# Altium schematic sheet RAM&GPIO.SchDoc: {Наименование}
size 420 x 297 mm; DocumentNumber: ПЛАС.ХХХХХХ.ХХХ ХХ; SheetNumber: 9; SheetTotal: 11; PageSetup: Record=PageOptions|CenterHorizontal=False|CenterVertical=False|PrintScale=0.95|XCorrection=0.00|YCorrection=0.00|PrintKind=1|BorderSize=5000000|LeftOffset=0|BottomOffset=0|Orientation=1|PaperLength=1000|PaperWidth=1000|Scale=100|PaperSource=15|PrintQuality=600|MediaType=1|DitherType=10|PaperKind=A4|PrintScaleMode=1; Rule: PcbType=ProtelPcb
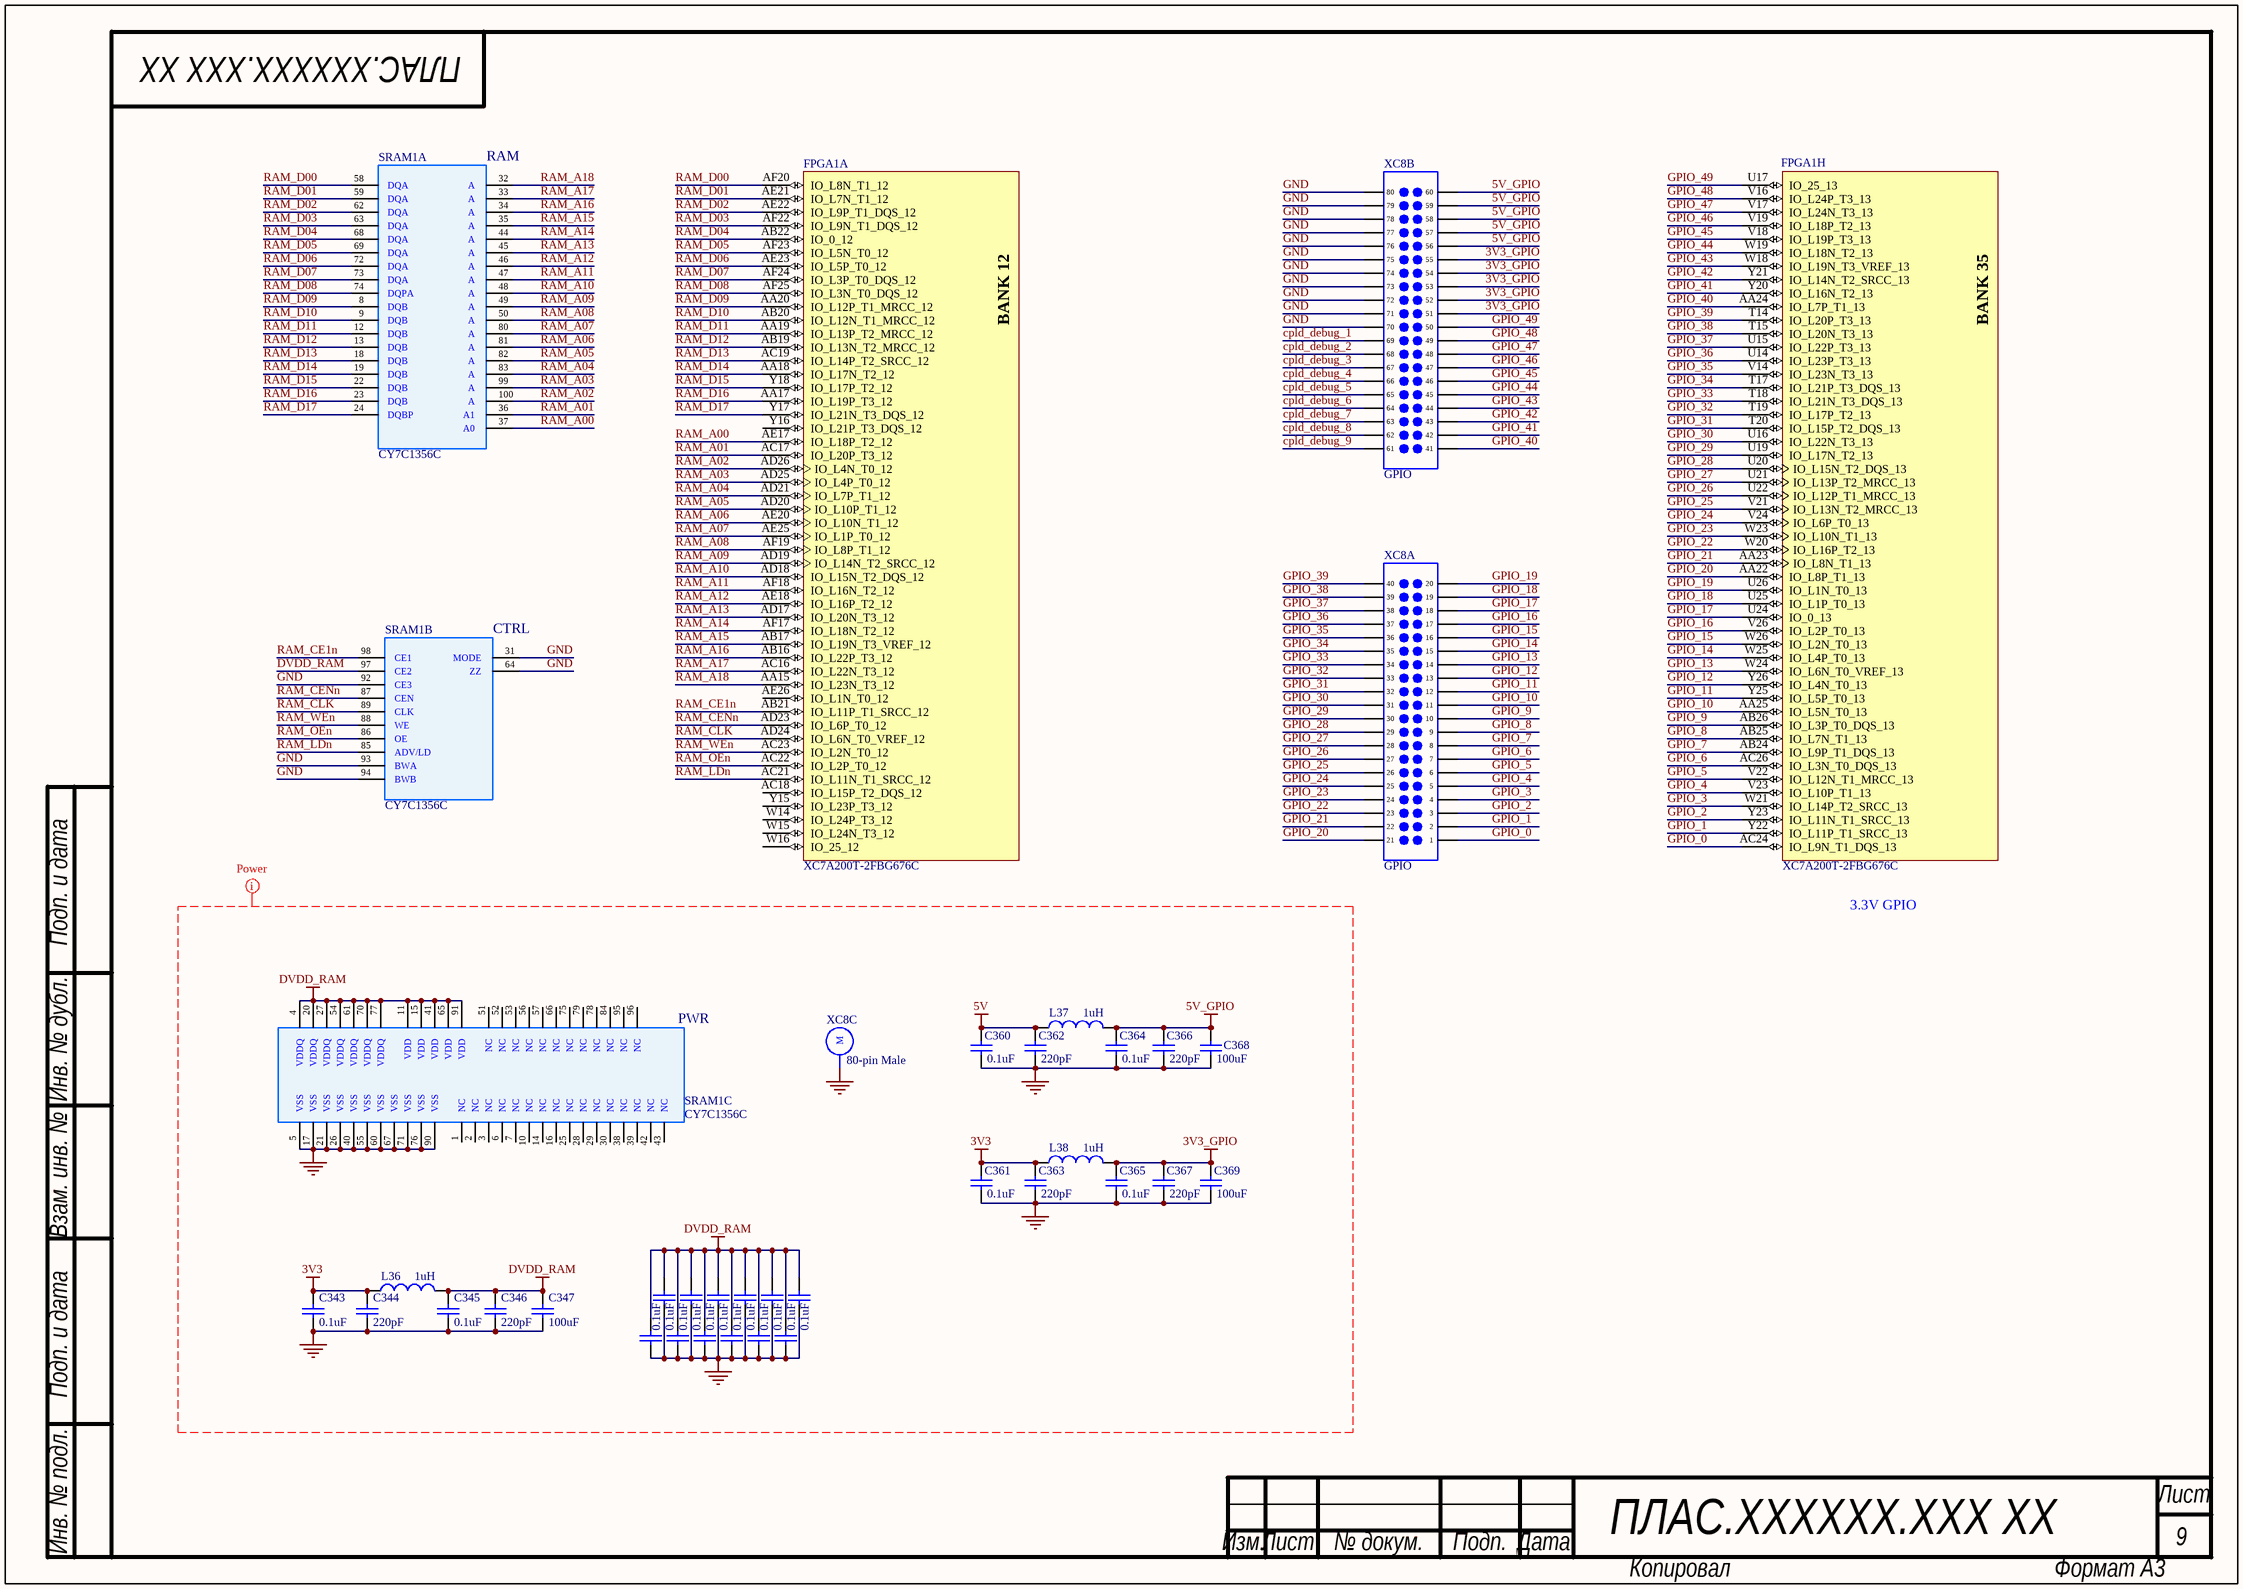
[diagram p0: RAM&GPIO.SchDoc]

## Parts
C343  value 0.1uF  [C0603]  (hidden comment: Cap)
C344  value 220pF  [C0603]  (hidden comment: Cap)
C345  value 0.1uF  [C0603]  (hidden comment: Cap)
C346  value 220pF  [C0603]  (hidden comment: Cap)
C347  value 100uF  [C1210]  (hidden comment: Cap)
C348  value 0.1uF  [С0402]  (hidden comment: Cap)
C349  value 0.1uF  [С0402]  (hidden comment: Cap)
C350  value 0.1uF  [С0402]  (hidden comment: Cap)
C351  value 0.1uF  [С0402]  (hidden comment: Cap)
C352  value 0.1uF  [С0402]  (hidden comment: Cap)
C353  value 0.1uF  [С0402]  (hidden comment: Cap)
C354  value 0.1uF  [С0402]  (hidden comment: Cap)
C355  value 0.1uF  [С0402]  (hidden comment: Cap)
C356  value 0.1uF  [С0402]  (hidden comment: Cap)
C357  value 0.1uF  [С0402]  (hidden comment: Cap)
C358  value 0.1uF  [С0402]  (hidden comment: Cap)
C359  value 0.1uF  [С0402]  (hidden comment: Cap)
C360  value 0.1uF  [C0603]  (hidden comment: Cap)
C361  value 0.1uF  [C0603]  (hidden comment: Cap)
C362  value 220pF  [C0603]  (hidden comment: Cap)
C363  value 220pF  [C0603]  (hidden comment: Cap)
C364  value 0.1uF  [C0603]  (hidden comment: Cap)
C365  value 0.1uF  [C0603]  (hidden comment: Cap)
C366  value 220pF  [C0603]  (hidden comment: Cap)
C367  value 220pF  [C0603]  (hidden comment: Cap)
C368  value 100uF  [C1210]  (hidden comment: Cap)
C369  value 100uF  [C1210]  (hidden comment: Cap)
FPGA1  XC7A200T-2FBG676C  [FGG676]  (parts A,H of 14)
L36  value 1uH  [L1210_Murata]  (hidden comment: Inductor_LF)
L37  value 1uH  [L1210_Murata LQH]  (hidden comment: Inductor_LF)
L38  value 1uH  [L1210_Murata LQH]  (hidden comment: Inductor_LF)
SRAM1  CY7C1356C  [TQFP-100]  (parts A,B,C of 3)
XC8  GPIO  [Molex_465572545]  (parts A,B,C of 3)

## Nets
3V3: C343.1 C344.1 C361.1 C363.1 L36.2 L38.2
3V3_GPIO: C365.1 C367.1 C369.2 L38.1 XC8.51 XC8.52 XC8.53 XC8.54 XC8.55
5V: C360.1 C362.1 L37.2
5V_GPIO: C364.1 C366.1 C368.1 L37.1 XC8.56 XC8.57 XC8.58 XC8.59 XC8.60
DVDD_RAM: C345.1 C346.1 C347.2 C348.2 C349.2 C350.2 C351.2 C352.2 C353.2 C354.2 C355.2 C356.2 C357.2 C358.2 C359.2 L36.1 SRAM1.4(VDDQ) SRAM1.11(VDD) SRAM1.15(VDD) SRAM1.20(VDDQ) SRAM1.27(VDDQ) SRAM1.41(VDD) SRAM1.54(VDDQ) SRAM1.61(VDDQ) SRAM1.65(VDD) SRAM1.70(VDDQ) SRAM1.77(VDDQ) SRAM1.91(VDD) SRAM1.97(CE2)
GND: C343.2 C344.2 C345.2 C346.2 C347.1 C348.1 C349.1 C350.1 C351.1 C352.1 C353.1 C354.1 C355.1 C356.1 C357.1 C358.1 C359.1 C360.2 C361.2 C362.2 C363.2 C364.2 C365.2 C366.2 C367.2 C368.2 C369.1 SRAM1.5(VSS) SRAM1.17(VSS) SRAM1.21(VSS) SRAM1.26(VSS) SRAM1.31(MODE) SRAM1.40(VSS) SRAM1.55(VSS) SRAM1.60(VSS) SRAM1.64(ZZ) SRAM1.67(VSS) SRAM1.71(VSS) SRAM1.76(VSS) SRAM1.90(VSS) SRAM1.92(CE3) SRAM1.93(BWA) SRAM1.94(BWB) XC8.0(M) XC8.70 XC8.71 XC8.72 XC8.73 XC8.74 XC8.75 XC8.76 XC8.77 XC8.78 XC8.79 XC8.80
cpld_debug_1: XC8.69
cpld_debug_2: XC8.68
cpld_debug_3: XC8.67
cpld_debug_4: XC8.66
cpld_debug_5: XC8.65
cpld_debug_6: XC8.64
cpld_debug_7: XC8.63
cpld_debug_8: XC8.62
cpld_debug_9: XC8.61
GPIO_0: FPGA1.AC24(IO_L9N_T1_DQS_13) XC8.1
GPIO_1: FPGA1.Y22(IO_L11P_T1_SRCC_13) XC8.2
GPIO_2: FPGA1.Y23(IO_L11N_T1_SRCC_13) XC8.3
GPIO_3: FPGA1.W21(IO_L14P_T2_SRCC_13) XC8.4
GPIO_4: FPGA1.V23(IO_L10P_T1_13) XC8.5
GPIO_5: FPGA1.V22(IO_L12N_T1_MRCC_13) XC8.6
GPIO_6: FPGA1.AC26(IO_L3N_T0_DQS_13) XC8.7
GPIO_7: FPGA1.AB24(IO_L9P_T1_DQS_13) XC8.8
GPIO_8: FPGA1.AB25(IO_L7N_T1_13) XC8.9
GPIO_9: FPGA1.AB26(IO_L3P_T0_DQS_13) XC8.10
GPIO_10: FPGA1.AA25(IO_L5N_T0_13) XC8.11
GPIO_11: FPGA1.Y25(IO_L5P_T0_13) XC8.12
GPIO_12: FPGA1.Y26(IO_L4N_T0_13) XC8.13
GPIO_13: FPGA1.W24(IO_L6N_T0_VREF_13) XC8.14
GPIO_14: FPGA1.W25(IO_L4P_T0_13) XC8.15
GPIO_15: FPGA1.W26(IO_L2N_T0_13) XC8.16
GPIO_16: FPGA1.V26(IO_L2P_T0_13) XC8.17
GPIO_17: FPGA1.U24(IO_0_13) XC8.18
GPIO_18: FPGA1.U25(IO_L1P_T0_13) XC8.19
GPIO_19: FPGA1.U26(IO_L1N_T0_13) XC8.20
GPIO_20: FPGA1.AA22(IO_L8P_T1_13) XC8.21
GPIO_21: FPGA1.AA23(IO_L8N_T1_13) XC8.22
GPIO_22: FPGA1.W20(IO_L16P_T2_13) XC8.23
GPIO_23: FPGA1.W23(IO_L10N_T1_13) XC8.24
GPIO_24: FPGA1.V24(IO_L6P_T0_13) XC8.25
GPIO_25: FPGA1.V21(IO_L13N_T2_MRCC_13) XC8.26
GPIO_26: FPGA1.U22(IO_L12P_T1_MRCC_13) XC8.27
GPIO_27: FPGA1.U21(IO_L13P_T2_MRCC_13) XC8.28
GPIO_28: FPGA1.U20(IO_L15N_T2_DQS_13) XC8.29
GPIO_29: FPGA1.U19(IO_L17N_T2_13) XC8.30
GPIO_30: FPGA1.U16(IO_L22N_T3_13) XC8.31
GPIO_31: FPGA1.T20(IO_L15P_T2_DQS_13) XC8.32
GPIO_32: FPGA1.T19(IO_L17P_T2_13) XC8.33
GPIO_33: FPGA1.T18(IO_L21N_T3_DQS_13) XC8.34
GPIO_34: FPGA1.T17(IO_L21P_T3_DQS_13) XC8.35
GPIO_35: FPGA1.V14(IO_L23N_T3_13) XC8.36
GPIO_36: FPGA1.U14(IO_L23P_T3_13) XC8.37
GPIO_37: FPGA1.U15(IO_L22P_T3_13) XC8.38
GPIO_38: FPGA1.T15(IO_L20N_T3_13) XC8.39
GPIO_39: FPGA1.T14(IO_L20P_T3_13) XC8.40
GPIO_40: FPGA1.AA24(IO_L7P_T1_13) XC8.41
GPIO_41: FPGA1.Y20(IO_L16N_T2_13) XC8.42
GPIO_42: FPGA1.Y21(IO_L14N_T2_SRCC_13) XC8.43
GPIO_43: FPGA1.W18(IO_L19N_T3_VREF_13) XC8.44
GPIO_44: FPGA1.W19(IO_L18N_T2_13) XC8.45
GPIO_45: FPGA1.V18(IO_L19P_T3_13) XC8.46
GPIO_46: FPGA1.V19(IO_L18P_T2_13) XC8.47
GPIO_47: FPGA1.V17(IO_L24N_T3_13) XC8.48
GPIO_48: FPGA1.V16(IO_L24P_T3_13) XC8.49
GPIO_49: FPGA1.U17(IO_25_13) XC8.50
RAM_A00: FPGA1.AE17(IO_L18P_T2_12) SRAM1.37(A0)
RAM_A01: FPGA1.AC17(IO_L20P_T3_12) SRAM1.36(A1)
RAM_A02: FPGA1.AD26(IO_L4N_T0_12) SRAM1.100(A)
RAM_A03: FPGA1.AD25(IO_L4P_T0_12) SRAM1.99(A)
RAM_A04: FPGA1.AD21(IO_L7P_T1_12) SRAM1.83(A)
RAM_A05: FPGA1.AD20(IO_L10P_T1_12) SRAM1.82(A)
RAM_A06: FPGA1.AE20(IO_L10N_T1_12) SRAM1.81(A)
RAM_A07: FPGA1.AE25(IO_L1P_T0_12) SRAM1.80(A)
RAM_A08: FPGA1.AF19(IO_L8P_T1_12) SRAM1.50(A)
RAM_A09: FPGA1.AD19(IO_L14N_T2_SRCC_12) SRAM1.49(A)
RAM_A10: FPGA1.AD18(IO_L15N_T2_DQS_12) SRAM1.48(A)
RAM_A11: FPGA1.AF18(IO_L16N_T2_12) SRAM1.47(A)
RAM_A12: FPGA1.AE18(IO_L16P_T2_12) SRAM1.46(A)
RAM_A13: FPGA1.AD17(IO_L20N_T3_12) SRAM1.45(A)
RAM_A14: FPGA1.AF17(IO_L18N_T2_12) SRAM1.44(A)
RAM_A15: FPGA1.AB17(IO_L19N_T3_VREF_12) SRAM1.35(A)
RAM_A16: FPGA1.AB16(IO_L22P_T3_12) SRAM1.34(A)
RAM_A17: FPGA1.AC16(IO_L22N_T3_12) SRAM1.33(A)
RAM_A18: FPGA1.AA15(IO_L23N_T3_12) SRAM1.32(A)
RAM_CE1n: FPGA1.AB21(IO_L11P_T1_SRCC_12) SRAM1.98(CE1)
RAM_CENn: FPGA1.AD23(IO_L6P_T0_12) SRAM1.87(CEN)
RAM_CLK: FPGA1.AD24(IO_L6N_T0_VREF_12) SRAM1.89(CLK)
RAM_D00: FPGA1.AF20(IO_L8N_T1_12) SRAM1.58(DQA)
RAM_D01: FPGA1.AE21(IO_L7N_T1_12) SRAM1.59(DQA)
RAM_D02: FPGA1.AE22(IO_L9P_T1_DQS_12) SRAM1.62(DQA)
RAM_D03: FPGA1.AF22(IO_L9N_T1_DQS_12) SRAM1.63(DQA)
RAM_D04: FPGA1.AB22(IO_0_12) SRAM1.68(DQA)
RAM_D05: FPGA1.AF23(IO_L5N_T0_12) SRAM1.69(DQA)
RAM_D06: FPGA1.AE23(IO_L5P_T0_12) SRAM1.72(DQA)
RAM_D07: FPGA1.AF24(IO_L3P_T0_DQS_12) SRAM1.73(DQA)
RAM_D08: FPGA1.AF25(IO_L3N_T0_DQS_12) SRAM1.74(DQPA)
RAM_D09: FPGA1.AA20(IO_L12P_T1_MRCC_12) SRAM1.8(DQB)
RAM_D10: FPGA1.AB20(IO_L12N_T1_MRCC_12) SRAM1.9(DQB)
RAM_D11: FPGA1.AA19(IO_L13P_T2_MRCC_12) SRAM1.12(DQB)
RAM_D12: FPGA1.AB19(IO_L13N_T2_MRCC_12) SRAM1.13(DQB)
RAM_D13: FPGA1.AC19(IO_L14P_T2_SRCC_12) SRAM1.18(DQB)
RAM_D14: FPGA1.AA18(IO_L17N_T2_12) SRAM1.19(DQB)
RAM_D15: FPGA1.Y18(IO_L17P_T2_12) SRAM1.22(DQB)
RAM_D16: FPGA1.AA17(IO_L19P_T3_12) SRAM1.23(DQB)
RAM_D17: FPGA1.Y17(IO_L21N_T3_DQS_12) SRAM1.24(DQBP)
RAM_LDn: FPGA1.AC21(IO_L11N_T1_SRCC_12) SRAM1.85(ADV/LD)
RAM_OEn: FPGA1.AC22(IO_L2P_T0_12) SRAM1.86(OE)
RAM_WEn: FPGA1.AC23(IO_L2N_T0_12) SRAM1.88(WE)

Not connected (* = marked no-connect by the designer): FPGA1 AC18(IO_L15P_T2_DQS_12) AE26(IO_L1N_T0_12) W14(IO_L24P_T3_12) W15(IO_L24N_T3_12) W16(IO_25_12) Y15(IO_L23P_T3_12) Y16(IO_L21P_T3_DQS_12); SRAM1 1(NC) 2(NC) 3(NC) 6(NC) 7(NC) 10(NC) 14(NC) 16(NC) 25(NC) 28(NC) 29(NC) 30(NC) 38(NC) 39(NC) 42(NC) 43(NC) 51(NC) 52(NC) 53(NC) 56(NC) 57(NC) 66(NC) 75(NC) 78(NC) 79(NC) 84(NC) 95(NC) 96(NC)

## Layout directives
net class Power: 3V3, 3V3_GPIO, 5V, 5V_GPIO, DVDD_RAM, GND

## Notes on the sheet
- 3.3V GPIO
- Подп. и дата
- Инв. № дубл.
- Взам. инв. №
- Инв. № подл.
- Лист
- Изм.
- № докум.
- Подп.
- Дата
- Копировал
- Формат А3
- (in symbol CY7C1356C, part A) RAM
- (in symbol CY7C1356C, part B) CTRL
- (in symbol CY7C1356C, part C) PWR
- (in symbol XC7A200T-2FBG676C, part A) BANK 12
- (in symbol XC7A200T-2FBG676C, part H) BANK 35

## Library data of the parts
C343-C346 C360-C367 = Cer Cap: Cer Cap Small; Manufacturer: Murata; Material: x5r; Voltage: 16V; Tolerance: 10%; Type: Ceramic; PackageReference: SMD Chip Capacitor; Package: 0603
C347 C368 C369 = Cap uF: Cer Cap Large; Manufacturer: Murata; Material: x5r; Tolerance: 20%; Voltage: 6.3V; Type: Ceramic; Package: C1210; PackageDescription: SMD Chip Capacitor
C348-C359 = Cer Cap: Cer Cap Small; Manufacturer: Murata; Material: x7r; Voltage: 50V; Tolerance: 10%; Type: Ceramic; PackageReference: SMD Chip Capacitor; Package: 0402
FPGA1 = XC7A200T-2FBG676C: Artix-7 FPGA, 400 User I/Os, 8 GTP, 676-Ball BGA, Speed Grade 2, Commercial Grade, Pb-Free; Manufacturer: Xilinx; Block RAM Blocks (18Kb): 730; Block RAM Blocks (36Kb): 365; Block RAM Blocks (Max Kb): 13140; CLBs (Slices): 33650; Clock Mgmt Tiles (CMTs): 10; DSP48E1 Slices: 740; Logic Cells: 215360; Max User I/O: 500; Speed Grade: -2; DatasheetVersion: v1.12; PackageVersion: Rev 1.8; PackageReference: FBG676; PackageDescription: Flip-Chip Lidless BGA, Body 27 x 27 mm, 1.0 mm Pitch; Supplier 1: Digi-Key; Supplier Part Number 1: 122-1865-ND; CLBs (Max Distributed RAM Kb): 2888; Generic Part Number: XC7A200T; RoHS: Pb-Free; NexusDeviceID: XC7A200T-2FBG676C; Mounting Technology: Surface Mount; Code_JEDEC: MS-034; PartNumber: XC7A200T-2FBG676C; ComponentLink1Description: Manufacturer URL; ComponentLink1URL: http://www.xilinx.com/; ComponentLink2Description: Datasheet; ComponentLink2URL: http://www.xilinx.com/support/documentation/data_sheets/ds180_7Series_Overview.pdf; ComponentLink3Description: Package Specification; ComponentLink3URL: http://www.xilinx.com/support/documentation/user_guides/ug475_7Series_Pkg_Pinout.pdf; ComponentLink4Description: DC and Switching Characteristics; ComponentLink4URL: http://www.xilinx.com/support/documentation/data_sheets/ds181_Artix_7_Data_Sheet.pdf; ComponentLink5Description: Package File; ComponentLink5URL: http://www.xilinx.com/support/packagefiles/a7packages/xc7a200tfbg676pkg.txt; ComponentLink6Description: Packaging and Pinout; ComponentLink6URL: http://www.xilinx.com/support/documentation/user_guides/ug475_7Series_Pkg_Pinout.pdf
L36 = Inductor_LF: Inductor_Power_Lines; Manufacturer: Murata; Name: LQM32PN1R0MG0; Tolerance: 5%; Current: 1800mA; Frequency: 60MHz; Package: 1210; PackageDescription: Chip Inductor; Temperature Range: -25…85; Series: LQM
L37 L38 = Inductor_LF: Inductor_Power_Lines; Manufacturer: Murata; Name: LQH32PN1R0NNC; Tolerance: 5%; Current: 2500mA; Frequency: 100MHz; Package: 1210; PackageDescription: Chip Inductor; Temperature Range: -25…85; Series: LQH
SRAM1 = CY7C1356C: Pipelined SRAM with NoBL; Name: CY7C1356C-250AXC; Voltage: 3.3 V; Type: 9-Mbit (512 K × 18); Package: 100-pin TQFP (14 × 20 × 1.4 mm)
XC8 = Molex_SEARAY™ 46557: CONN FML 80POS 4ROWS GOLD SMD; Manufacturer: Molex; Name: High Density Array, Female; Pitch: 0.050" (1.27mm); Number of Positions: 80; P/N: 46557-2545; Mates With: SEARAY™ 46556 Series; Series: SEARAY™ 46557; Number of Rows: 4; Mounting Type: Surface Mount